# EAGLE design RELAY_GND_STATION (EAGLE 9.0.0)
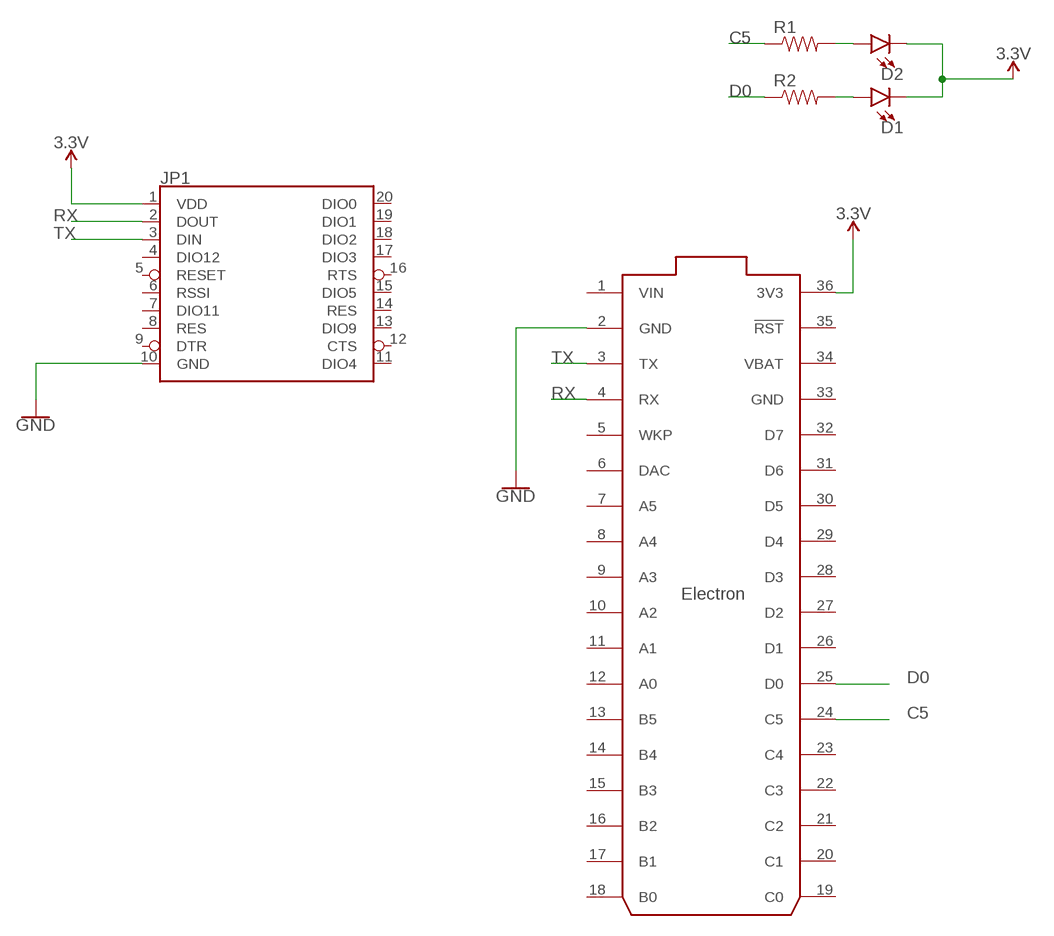
[diagram p0: schematic, sheet 1]

## Parts
D1  LED-3MM-NO_SILK  [LED_3MM-NS]
D2  LED-3MM-NO_SILK  [LED_3MM-NS]
JP1  XBEELONGPAD  [XBEE-LONGPAD]
R1  RESISTORKIT  [AXIAL-0.3-KIT]
R2  RESISTORKIT  [AXIAL-0.3-KIT]
U$1  ELECTRON_WITH_HEADERS  [ELECTRON]

## Nets
3.3V: D1.K(C) D2.K(C) JP1.1(VDD) U$1.36(3V3)
C5: R1.P$1 U$1.24(C5)
D0: R2.P$1 U$1.25(D0)
GND: JP1.10(GND) U$1.2(GND)
N$2: D2.A R1.P$2
N$3: D1.A R2.P$2
RX: JP1.2(DOUT) U$1.4(RX)
TX: JP1.3(DIN) U$1.3(TX)
Unconnected: JP1.4(DIO12) JP1.5(RESET) JP1.6(RSSI) JP1.7(DIO11) JP1.8(RES) JP1.9(DTR) JP1.11(DIO4) JP1.12(CTS) JP1.13(DIO9) JP1.14(RES) JP1.15(DIO5) JP1.16(RTS) JP1.17(DIO3) JP1.18(DIO2) JP1.19(DIO1) JP1.20(DIO0) U$1.5(WKP) U$1.6(DAC) U$1.7(A5) U$1.8(A4) U$1.9(A3) U$1.10(A2) U$1.11(A1) U$1.12(A0) U$1.13(B5) U$1.14(B4) U$1.15(B3) U$1.16(B2) U$1.17(B1) U$1.18(B0) U$1.19(C0) U$1.20(C1) U$1.21(C2) U$1.22(C3) U$1.23(C4) U$1.26(D1) U$1.27(D2) U$1.28(D3) U$1.29(D4) U$1.30(D5) U$1.31(D6) U$1.32(D7) U$1.35(!RST)

## Power pins joined to a net without a drawn wire
GND: U$1.33(GND)
VBAT: U$1.34(VBAT)
VIN: U$1.1(VIN)

## Library data of the parts
D1 D2 = SparkFun-LED:LED: LED (Generic) Standard schematic elements and footprints for 5mm, 3mm, 1206, and 0603 sized LEDs. Generic LEDs with no color specified.
JP1 = SparkFun-RF:XBEE: Digi XBee and XBee Pro XBees are tiny blue chips that can communicate wirelessly with each other. They can do simple things, like replacing a couple of wires in serial communication, which is nice when you want to make a remote for your paintball vehicle. SparkFun Products SparkFun XBee Buying Guide <https://www.sparkfun.com/pages/xbee_guide> SparkFun XBee Explorer USB <https://www.sparkfun.com/products/11812> (WRL-11812) Breakout Board for XBee Module <https://www.sparkfun.com/products/8276> (WRL-8276) SparkFun XBee Explorer Regulated <https://www.sparkfun.com/products/11373> (WRL-11373) SparkFun XBee Explorer Dongle <https://www.sparkfun.com/products/11697> (WRL-11697) SparkFun XBee Shield <https://www.sparkfun.com/products/12847> (WRL-12847) SparkFun XBee Explorer Serial <https://www.sparkfun.com/products/13225> (WRL-13225)
R1 R2 = SparkFun-Passives:RESISTOR: Resistor Basic schematic elements and footprints for 0603, 1206, and PTH resistors.
U$1 = Particle-Devices:ELECTRON: Particle Electron footprint

## Board
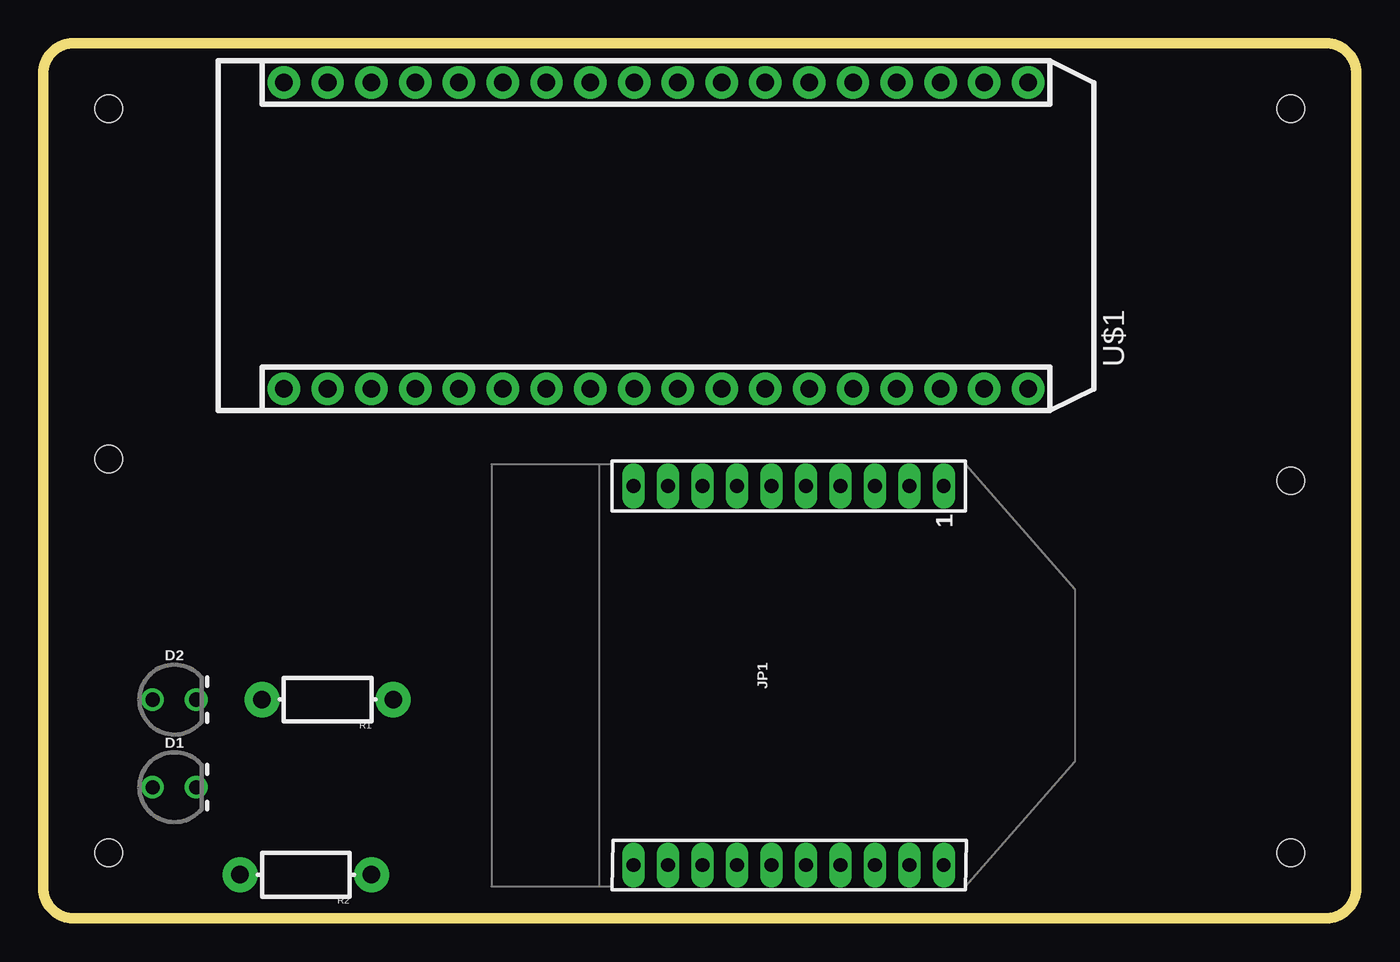
[diagram p1: board, top side]
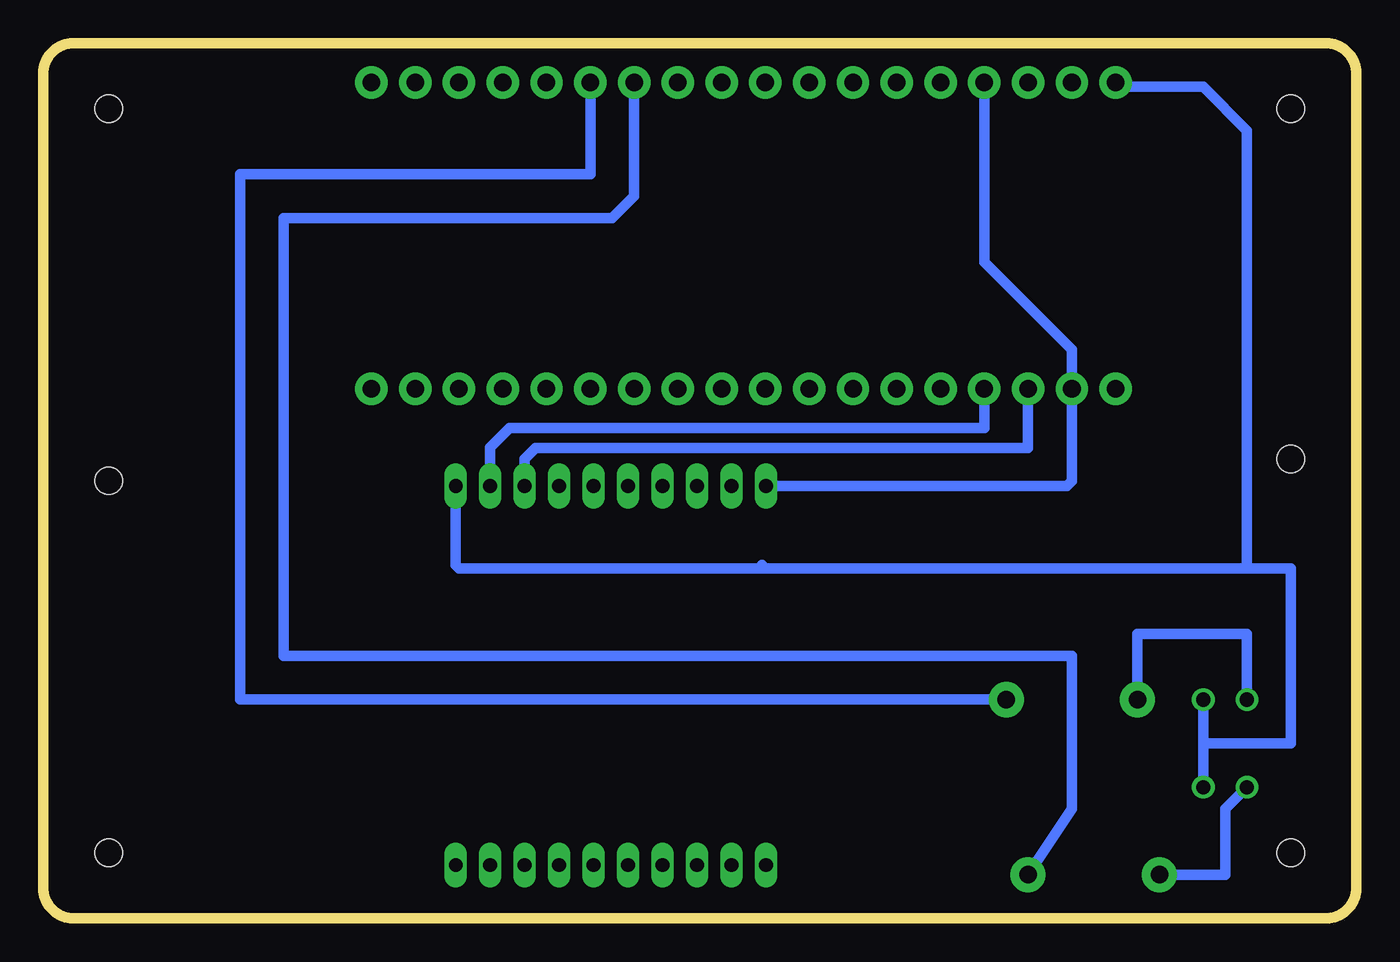
[diagram p2: board, bottom side, seen from below]

Size 76.2 x 50.8 mm. Coordinates in mm from the lower left corner, seen from the top.
Outline: 74.42,0 1.78,0 arc-90 0,1.78 0,49.02 arc-90 1.78,50.8 74.42,50.8 arc-90 76.2,49.02 76.2,1.78 arc-90 74.42,0
Copper layers (1*16): Top 0.035mm / dielectric 1.5mm / Bottom 0.035mm
Design rules "default": minimum track width 6mil, minimum drill 0.35mm, track to track 6mil, track to pad 6mil, pad to pad 6mil, via to via 6mil, smd to smd 6mil, copper to edge 40mil, drill to drill 6mil, minimum pad ring 10mil, minimum via ring 8mil, stop-mask expansion 4mil, vias tented up to drill 0mil, thermal gap 10mil
Holes 1.57 mm at 3.81,46.99 72.39,46.99 72.39,3.81 3.81,3.81 3.81,26.67 72.39,25.4

### Footprints (pad centres in the part's own frame; a part is rotated, then mirrored left to right if it is on the bottom)
LED_3MM-NS = drill 0.813: A -1.27,0; K 1.27,0
XBEE-LONGPAD = drill 0.8 pad 1.206 long: 1 -11,20; 2 -11,18; 3 -11,16; 4 -11,14; 5 -11,12; 6 -11,10; 7 -11,8; 8 -11,6; 9 -11,4; 10 -11,2; 11 11,2; 12 11,4; 13 11,6; 14 11,8; 15 11,10; 16 11,12; 17 11,14; 18 11,16; 19 11,18; 20 11,20
AXIAL-0.3-KIT = drill 1.016 pad 2.032: P$1 -3.81,0; P$2 3.81,0
ELECTRON = drill 1.016 pad 1.88: 1 1.27,46.99; 2 1.27,44.45; 3 1.27,41.91; 4 1.27,39.37; 5 1.27,36.83; 6 1.27,34.29; 7 1.27,31.75; 8 1.27,29.21; 9 1.27,26.67; 10 1.27,24.13; 11 1.27,21.59; 12 1.27,19.05; 13 1.27,16.51; 14 1.27,13.97; 15 1.27,11.43; 16 1.27,8.89; 17 1.27,6.35; 18 1.27,3.81; 19 19.05,3.81; 20 19.05,6.35; 21 19.05,8.89; 22 19.05,11.43; 23 19.05,13.97; 24 19.05,16.51; 25 19.05,19.05; 26 19.05,21.59; 27 19.05,24.13; 28 19.05,26.67; 29 19.05,29.21; 30 19.05,31.75; 31 19.05,34.29; 32 19.05,36.83; 33 19.05,39.37; 34 19.05,41.91; 35 19.05,44.45; 36 19.05,46.99

### Placement (x,y rotation side)
D1  7.62,7.62 0 top
D2  7.62,12.7 0 top
JP1  32.26,14.1 270 top
R1  16.51,12.7 180 top
R2  15.24,2.54 180 top
U$1  60.96,29.46 90 top

### Tracks (layer width: path | path; a pad name or v marks a point on that pad's centre or on a via)
3.3V
  Bottom 0.61: 34.29,20.32 34.48,20.51 | 34.29,20.32 52.07,20.32 52.26,20.51 JP1.1 | U$1.36 13.72,48.26 8.89,48.26 6.35,45.72 6.35,20.32 | 6.35,20.32 34.29,20.32 | D2.K 8.89,10.16 | 8.89,10.16 D1.K | 8.89,10.16 3.81,10.16 3.81,20.32 6.35,20.32
C5
  Bottom 0.61: R1.P$1 64.77,12.7 64.77,43.18 44.45,43.18 U$1.24
D0
  Bottom 0.61: U$1.25 41.91,41.91 43.18,40.64 62.23,40.64 62.23,15.24 16.51,15.24 16.51,6.35 R2.P$1
GND
  Bottom 0.61: U$1.33 21.59,38.1 16.51,33.02 U$1.2 16.51,25.4 16.81,25.1 JP1.10
N$2
  Bottom 0.61: D2.A 6.35,16.51 12.7,16.51 R1.P$2
N$3
  Bottom 0.61: D1.A 7.62,6.35 7.62,2.54 R2.P$2
RX
  Bottom 0.61: U$1.4 21.59,28.45 49.15,28.45 50.26,27.34 JP1.2
TX
  Bottom 0.61: U$1.3 19.05,27.3 47.62,27.3 48.26,26.67 JP1.3